# Altium schematic sheet IMU3000.SchDoc: IMU 3000
size Letter
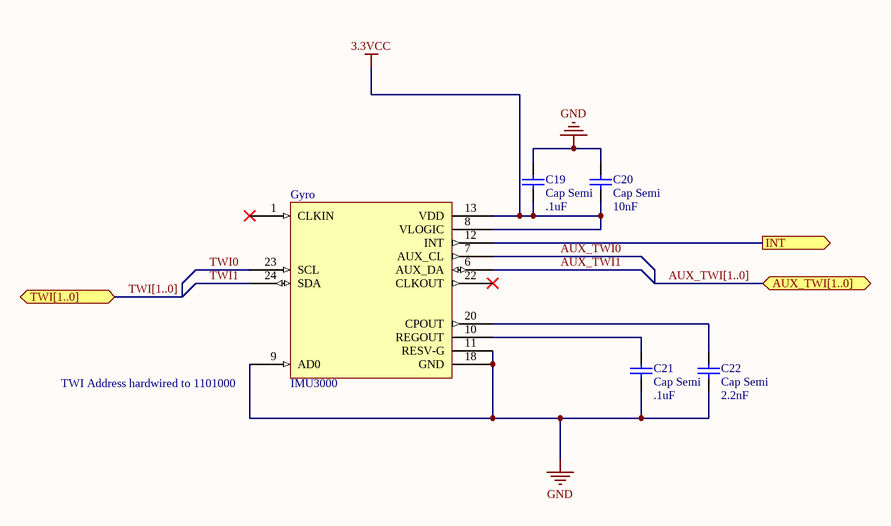
[diagram p0: IMU3000.SchDoc]

## Parts
C19  Cap Semi  value .1uF  [CAPC2012N]
C20  Cap Semi  value 10nF  [CAPC2012N]
C21  Cap Semi  value .1uF  [CAPC2012N]
C22  Cap Semi  value 2.2nF  [CAPC2012N]
Gyro  IMU3000  [IMU3000 - ECESHOP]

## Ports
AUX_TWI[1..0] (bidir), INT (out), TWI[1..0] (bidir)

## Nets
3.3VCC: C19.2 C20.2 Gyro.8(VLOGIC) Gyro.13(VDD)
GND: C19.1 C20.1 C21.1 C22.1 Gyro.9(AD0) Gyro.11(RESV-G) Gyro.18(GND)
AUX_TWI0: Gyro.7(AUX_CL)
AUX_TWI1: Gyro.6(AUX_DA)
INT: Gyro.12(INT) ; port INT
TWI0: Gyro.23(SCL)
TWI1: Gyro.24(SDA)
NetC21_2: C21.2 Gyro.10(REGOUT)
NetC22_2: C22.2 Gyro.20(CPOUT)

Not connected (* = marked no-connect by the designer): Gyro 1(CLKIN)* 22(CLKOUT)*

## Buses and harness runs
bus AUX_TWI[1..0] = port AUX_TWI[1..0]
bus TWI[1..0] = port TWI[1..0]

## Notes on the sheet
- (near Gyro) TWI Address hardwired to 1101000
- Title
- Size:
- Date:
- Letter
- Number:
- Time:
- Revision:
- Sheet
- of
- File:

## Library data of the parts
C19-C22 = Cap Semi: Capacitor (Semiconductor SIM Model); Published: 8-Jun-2000; LatestRevisionDate: 29-May-2009; LatestRevisionNote: IPC-7351 Footprint Added.; PackageReference: C1206; Publisher: Altium Limited; PackageDescription: Chip Capacitor